# Altium schematic sheet RS-485.SchDoc
size 420 x 297 mm; Address1: Address1; Address2: Address2; Address3: Address3; Address4: Address4; DocumentNumber: *Э*; SheetNumber: 12; SheetTotal: 14; DocumentType: Схема электрическая *
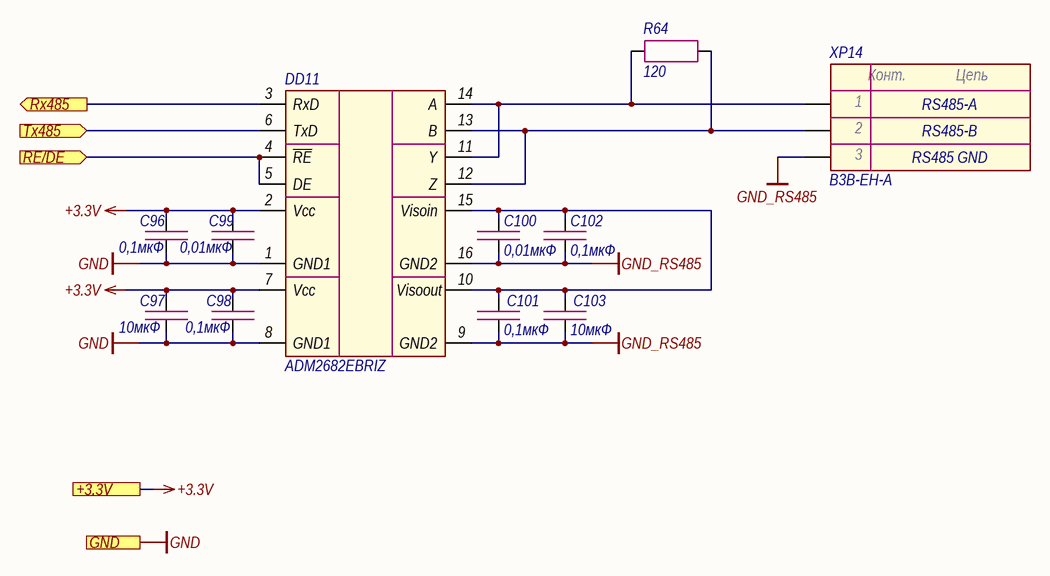
[diagram p0: RS-485.SchDoc]

## Parts
C96  0,1мкФ  [CAP_0603]
C97  10мкФ  [CAP_0603]
C98  0,1мкФ  [CAP_0603]
C99  0,01мкФ  [CAP_0603]
C100  0,01мкФ  [CAP_0603]
C101  0,1мкФ  [CAP_0603]
C102  0,1мкФ  [CAP_0603]
C103  10мкФ  [CAP_0603]
DD11  ADM2682EBRIZ  [SOIC-16IC]
R64  120  [RES_0603]
XP14  B3B-EH-A  [B3B-EH-A]

## Ports
+3.3V (see Main[1C], Button[1D], Ethernet[3D], Fiber_interlock[2C], Flow_sensor[2C], LD_driver[1D], Power_supply[2C]), GND (see Main[1C], Button[1D], Column[1C], Ethernet[3D], Fiber_interlock[2C], Flow_sensor[2C], Guide_laser[1C], Indication[1C], LD_driver[1D], Power_supply[2C]), RE/DE (in, see Main[1C]), Rx485 (out, see Main[1C]), Tx485 (in, see Main[1C])

## Nets
+3.3V: C96.1 C97.1 C98.1 C99.2 DD11.2(Vcc) DD11.7(Vcc) ; port +3.3V
GND: C96.2 C97.2 C98.2 C99.1 DD11.1(GND1) DD11.8(GND1) ; port GND
GND_RS485: C100.1 C101.2 C102.2 C103.2 DD11.9(GND2) DD11.16(GND2) XP14.3
RE/DE: DD11.4(~{RE}) DD11.5(DE) ; port RE/DE
Rx485: DD11.3(RxD) ; port Rx485
Tx485: DD11.6(TxD) ; port Tx485
NetC100_2: C100.2 C101.1 C102.1 C103.1 DD11.10(Visoout) DD11.15(Visoin)
NetDD11_11: DD11.11(Y) DD11.14(A) R64.1 XP14.1
NetDD11_12: DD11.12(Z) DD11.13(B) R64.2 XP14.2

## Notes on the sheet
- RS485-A
- RS485-B
- RS485 GND
- Подп. и дата
- Инв. № дубл.
- Взам. инв. №
- Инв. № подл.
- Изм.
- Лист
- № докум.
- Подп.
- Дата
- Копировал
- Формат А3
- (in symbol Connector-3) Конт.; Цепь

## Library data of the parts
C96 C98 C101 C102 = Capacitor: Manufacturer: Murata; Model: GRM188R71H104KA93D; Value: 0,1мкФ; Document: *
C97 C103 = Capacitor: Manufacturer: Murata; Model: GRM188R61E106KA73D; Value: 10мкФ; Document: *
C99 C100 = Capacitor: Manufacturer: Murata; Model: GRM188R71H103KA01D; Value: 0,01мкФ; Document: *
DD11 = ADM2682EBRIZ: Manufacturer: Analog Devices; Model: ADM2682EBRIZ; Document: *
R64 = Resistor: Manufacturer: Yageo; Model: RC0603FR-07120RL; Value: 120; Document: *
XP14 = Connector-3: Manufacturer: JST; Model: B3B-EH-A; Document: *